# EAGLE design pianocircuit (EAGLE 9.6.2)
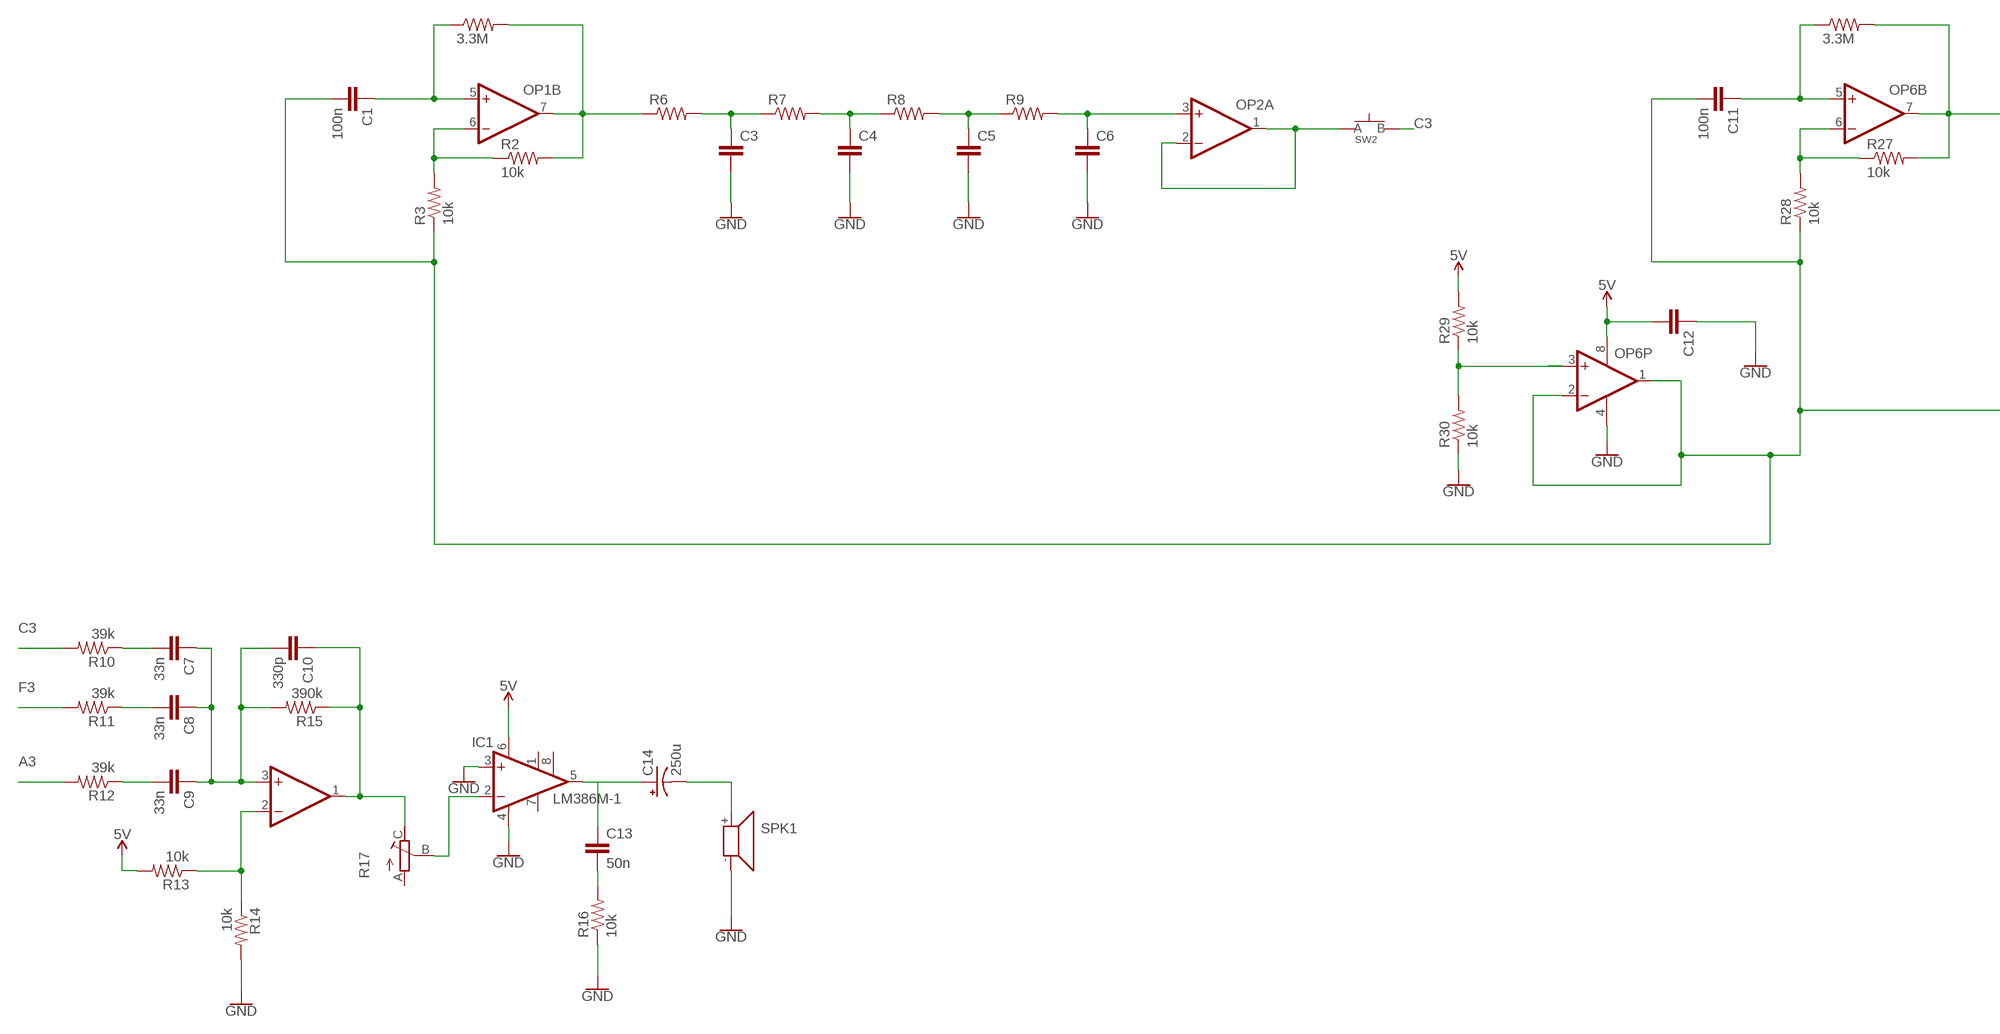
[diagram p0: schematic, sheet 1, part 1 of 2]
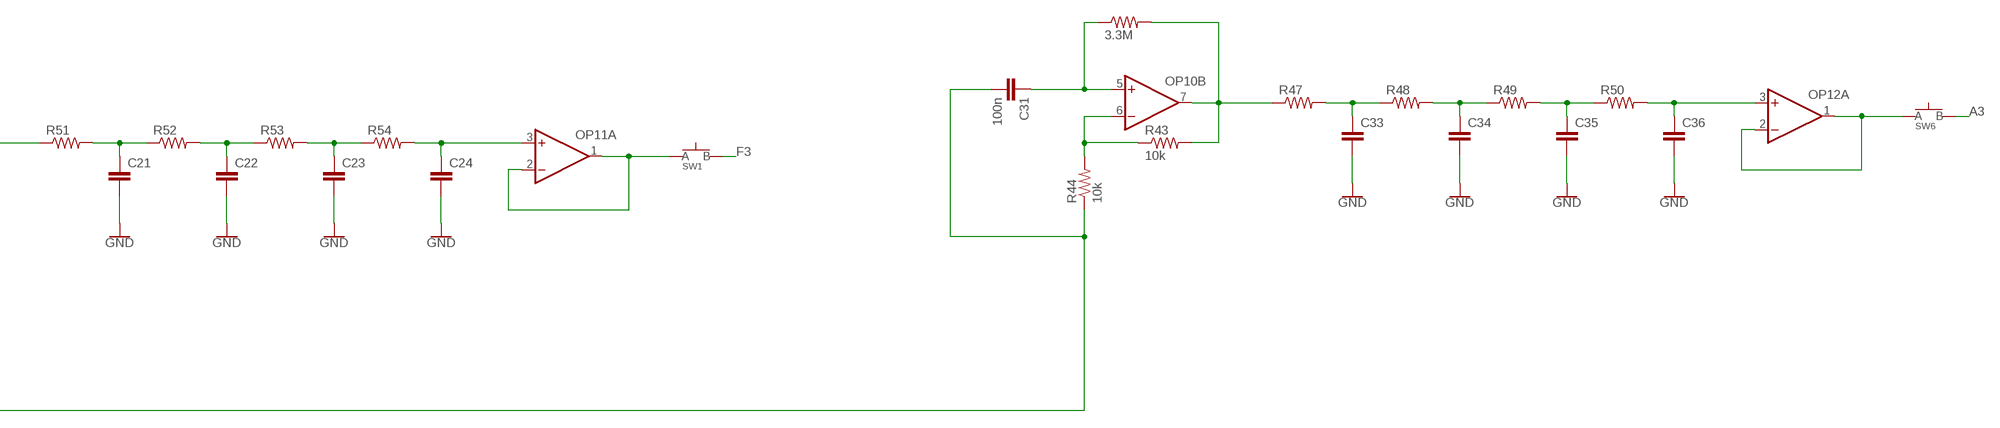
[diagram p1: schematic, sheet 1, part 2 of 2]

## Parts
C1  100n  CAPACITOR0603  [C0603]
C3  CAPACITOR0603  [C0603]
C4  CAPACITOR0603  [C0603]
C5  CAPACITOR0603  [C0603]
C6  CAPACITOR0603  [C0603]
C7  33n  CAPACITOR0603  [C0603]
C8  33n  CAPACITOR0603  [C0603]
C9  33n  CAPACITOR0603  [C0603]
C10  330p  CAPACITOR0603  [C0603]
C11  100n  CAPACITOR0603  [C0603]
C12  CAPACITOR0603  [C0603]
C13  50n  CAPACITOR0603  [C0603]
C14  250u  CAPACITOR.POLARC-EEU-FM-A-220UF  [C-EEU-FM-A-220UF]
C21  CAPACITOR0603  [C0603]
C22  CAPACITOR0603  [C0603]
C23  CAPACITOR0603  [C0603]
C24  CAPACITOR0603  [C0603]
C31  100n  CAPACITOR0603  [C0603]
C33  CAPACITOR0603  [C0603]
C34  CAPACITOR0603  [C0603]
C35  CAPACITOR0603  [C0603]
C36  CAPACITOR0603  [C0603]
IC1  LM386M-1  [SO08]
OP1  OP-DUALR  [SO8]
OP2  OP-DUALR  [SO8]
OP3  OP-DUALR  [SO8]
OP6  OP-DUALR  [SO8]
OP10  OP-DUALR  [SO8]
OP11  OP-DUALR  [SO8]
OP12  OP-DUALR  [SO8]
R1  3.3M  RESISTOR0603  [R0603]
R2  10k  RESISTOR0603  [R0603]
R3  10k  RESISTOR0603  [R0603]
R4  3.3M  RESISTOR0603  [R0603]
R6  RESISTOR0603  [R0603]
R7  RESISTOR0603  [R0603]
R8  RESISTOR0603  [R0603]
R9  RESISTOR0603  [R0603]
R10  39k  RESISTOR0603  [R0603]
R11  39k  RESISTOR0603  [R0603]
R12  39k  RESISTOR0603  [R0603]
R13  10k  RESISTOR0603  [R0603]
R14  10k  RESISTOR0603  [R0603]
R15  390k  RESISTOR0603  [R0603]
R16  10k  RESISTOR0603  [R0603]
R17  R-TRIMM-CB10V  [RTRIMCB10]
R26  3.3M  RESISTOR0603  [R0603]
R27  10k  RESISTOR0603  [R0603]
R28  10k  RESISTOR0603  [R0603]
R29  10k  RESISTOR0603  [R0603]
R30  10k  RESISTOR0603  [R0603]
R43  10k  RESISTOR0603  [R0603]
R44  10k  RESISTOR0603  [R0603]
R47  RESISTOR0603  [R0603]
R48  RESISTOR0603  [R0603]
R49  RESISTOR0603  [R0603]
R50  RESISTOR0603  [R0603]
R51  RESISTOR0603  [R0603]
R52  RESISTOR0603  [R0603]
R53  RESISTOR0603  [R0603]
R54  RESISTOR0603  [R0603]
SPK1  SPEAKER  [SOLDER.TABS]
SW1  SPST.KT11P4SM34LFS  [SPST.KT11P4SM34LFS]
SW2  SPST.KT11P4SM34LFS  [SPST.KT11P4SM34LFS]
SW6  SPST.KT11P4SM34LFS  [SPST.KT11P4SM34LFS]

## Nets
A3: R12.2 SW6.3(B) SW6.4(B)
C3: R10.2 SW2.3(B) SW2.4(B)
F3: R11.2 SW1.3(B) SW1.4(B)
N$2: C12.1 ; supply symbol labelled GND
N$3: C1.2 C11.2 C31.2 OP6.1(A:OUT) OP6.2(A:-IN) R3.1 R28.1 R44.1
N$4: OP1.6(B:-IN) R2.1 R3.2
N$5: C1.1 OP1.5(B:+IN) R1.1
N$6: OP1.7(B:OUT) R1.2 R2.2 R6.1
N$7: C3.1 R6.2 R7.1
N$8: C4.1 R7.2 R8.1
N$9: C5.1 R8.2 R9.1
N$10: C6.1 OP2.3(A:+IN) R9.2
N$11: OP2.1(A:OUT) OP2.2(A:-IN) SW2.1(A) SW2.2(A)
N$12: R4.2
N$14: C7.2 R10.1
N$15: C7.1 C8.1 C9.1 C10.2 OP3.3(A:+IN) R15.2
N$16: C9.2 R12.1
N$17: C8.2 R11.1
N$20: C10.1 OP3.1(A:OUT) R15.1 R17.C(E)
N$21: OP3.2(A:-IN) R13.1 R14.1
N$22: IC1.2(-IN) R17.B(S)
N$23: C13.2 R16.2
N$26: C13.1 C14.+ IC1.5(OUT)
N$27: OP6.3(A:+IN) R29.1 R30.2
N$29: OP6.6(B:-IN) R27.1 R28.2
N$30: C11.1 OP6.5(B:+IN) R26.1
N$31: OP6.7(B:OUT) R26.2 R27.2 R51.1
N$32: C14.- SPK1.+
N$52: C21.1 R51.2 R52.1
N$53: C22.1 R52.2 R53.1
N$54: C23.1 R53.2 R54.1
N$55: C24.1 OP11.3(A:+IN) R54.2
N$57: OP11.1(A:OUT) OP11.2(A:-IN) SW1.1(A) SW1.2(A)
N$58: OP10.6(B:-IN) R43.1 R44.2
N$60: C31.1 OP10.5(B:+IN) R4.1
N$61: OP10.7(B:OUT) R43.2 R47.1
N$62: C33.1 R47.2 R48.1
N$63: C34.1 R48.2 R49.1
N$64: C35.1 R49.2 R50.1
N$65: C36.1 OP12.3(A:+IN) R50.2
N$66: OP12.1(A:OUT) OP12.2(A:-IN) SW6.1(A) SW6.2(A)
V+: C12.2 IC1.6(VS) OP6.8(P:V+) R13.2 R29.2 ; supply symbol labelled 5V
V-: C3.2 C4.2 C5.2 C6.2 C21.2 C22.2 C23.2 C24.2 C33.2 C34.2 C35.2 C36.2 IC1.3(+IN) IC1.4(GND) OP6.4(P:V-) R14.2 R16.1 R30.1 SPK1.- ; supply symbol labelled GND
Unconnected: IC1.1(GAIN) IC1.7(BYPASS) IC1.8(GAIN) OP1.1(A:OUT) OP1.2(A:-IN) OP1.3(A:+IN) OP2.5(B:+IN) OP2.6(B:-IN) OP2.7(B:OUT) OP3.5(B:+IN) OP3.6(B:-IN) OP3.7(B:OUT) OP10.1(A:OUT) OP10.2(A:-IN) OP10.3(A:+IN) OP11.5(B:+IN) OP11.6(B:-IN) OP11.7(B:OUT) OP12.5(B:+IN) OP12.6(B:-IN) OP12.7(B:OUT) R17.A

## Power pins joined to a net without a drawn wire
V+: OP1.8(P:V+) OP2.8(P:V+) OP3.8(P:V+) OP10.8(P:V+) OP11.8(P:V+) OP12.8(P:V+)
V-: OP1.4(P:V-) OP2.4(P:V-) OP3.4(P:V-) OP10.4(P:V-) OP11.4(P:V-) OP12.4(P:V-)

## Library data of the parts
C1 C3-C13 C21-C24 C31 C33-C36 = LinnesLab-Passives:CAPACITOR
C14 = LinnesLab-Passives:CAPACITOR.POLAR
IC1 = linear:LM386?-*: Low Voltage Audio Power Amplifier Source: http://cache.national.com/ds/LM/LM386.pdf
OP1-OP3 OP6 OP10-OP12 = LinnesLab-AnalogIC:OP-DUAL: Precision Micropower, Low Noise CMOS, Rail-to-Rail Input/Output Operational Amplifiers Source: http://www.analog.com/static/imported-files/data_sheets/AD8603_8607_8609.pdf; MPN: AD8607ARMZ-R2; OC_FARNELL: 1651293; OC_NEWARK: 19M8927
R1-R4 R6-R16 R26-R30 R43 R44 R47-R54 = LinnesLab-Passives:RESISTOR
R17 = LinnesLab-Passives:R-TRIMM: Trimm resistor
SPK1 = LinnesLab-Electromechanical:SPEAKER
SW1 SW2 SW6 = LinnesLab-Switches:SPST.KT11P4SM34LFS: https://www.ckswitches.com/media/1468/kt.pdf

## Board
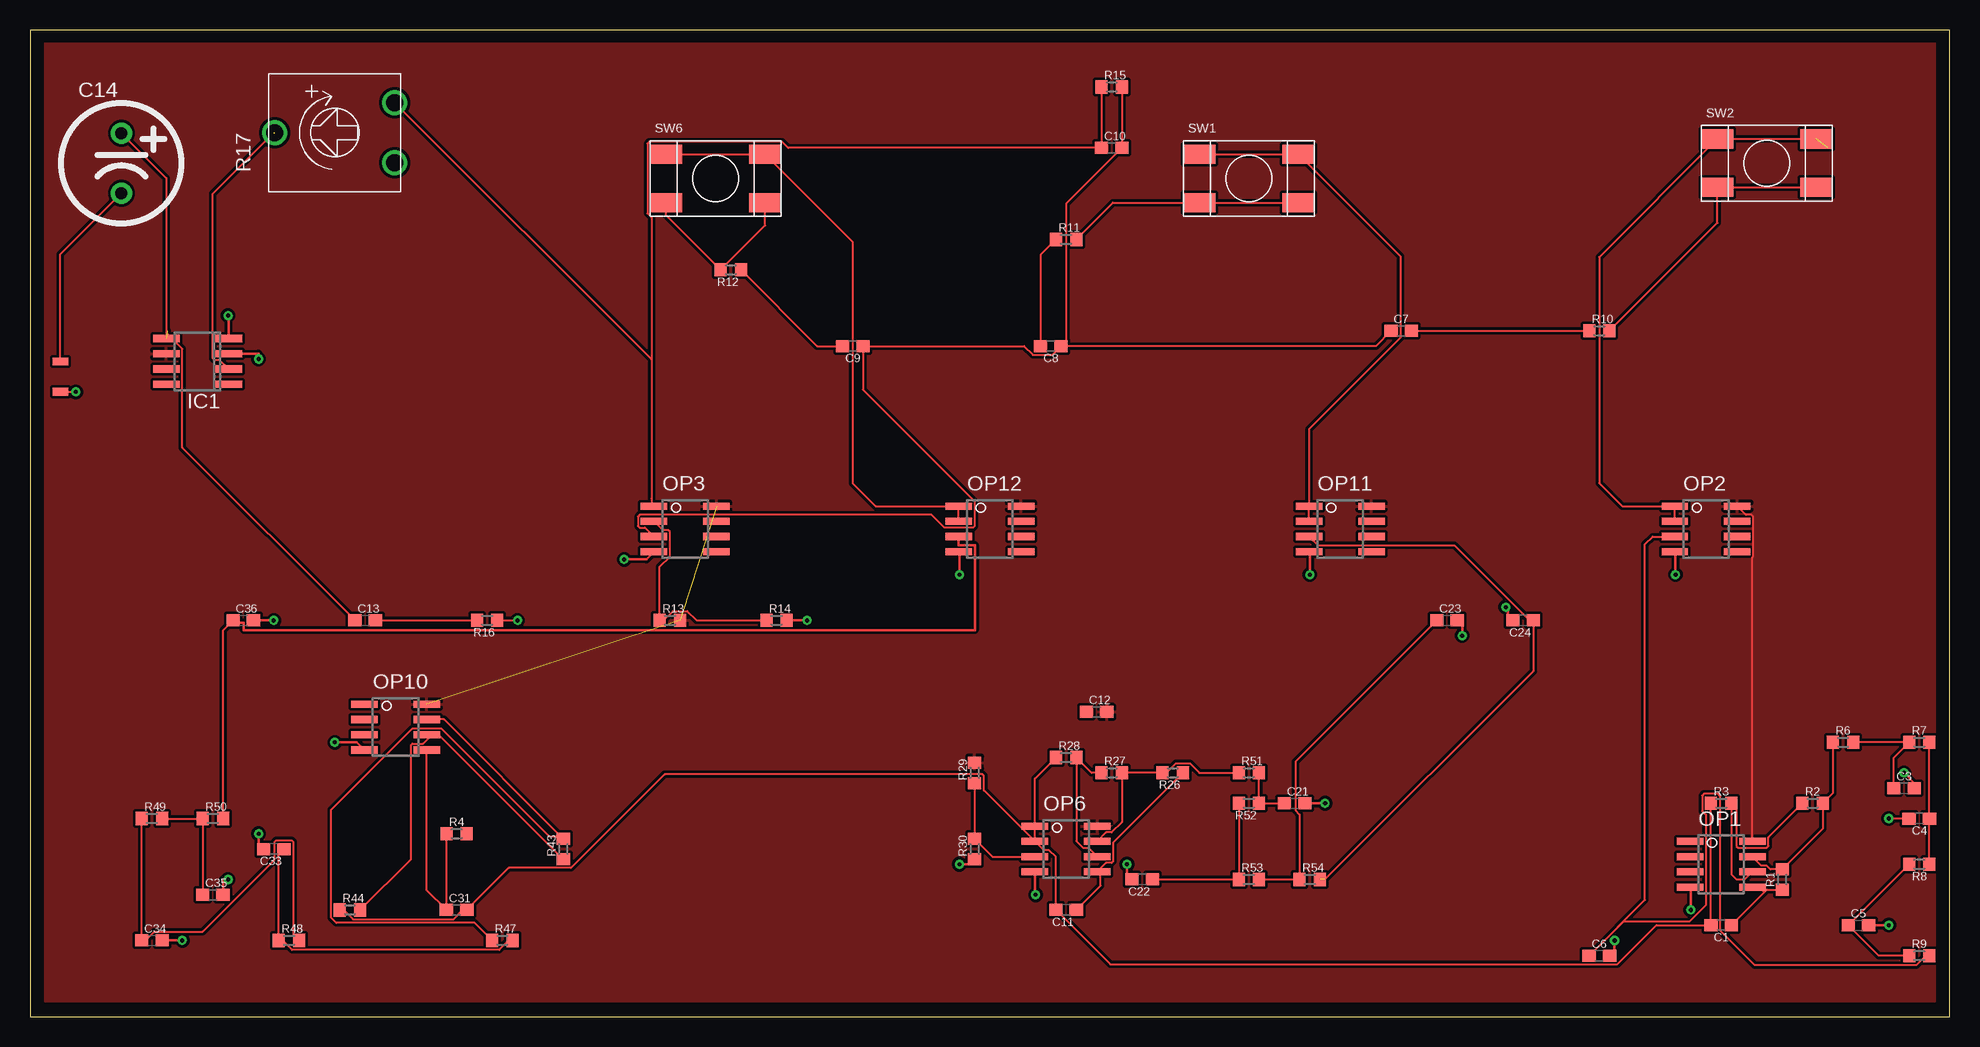
[diagram p2: board, top side]
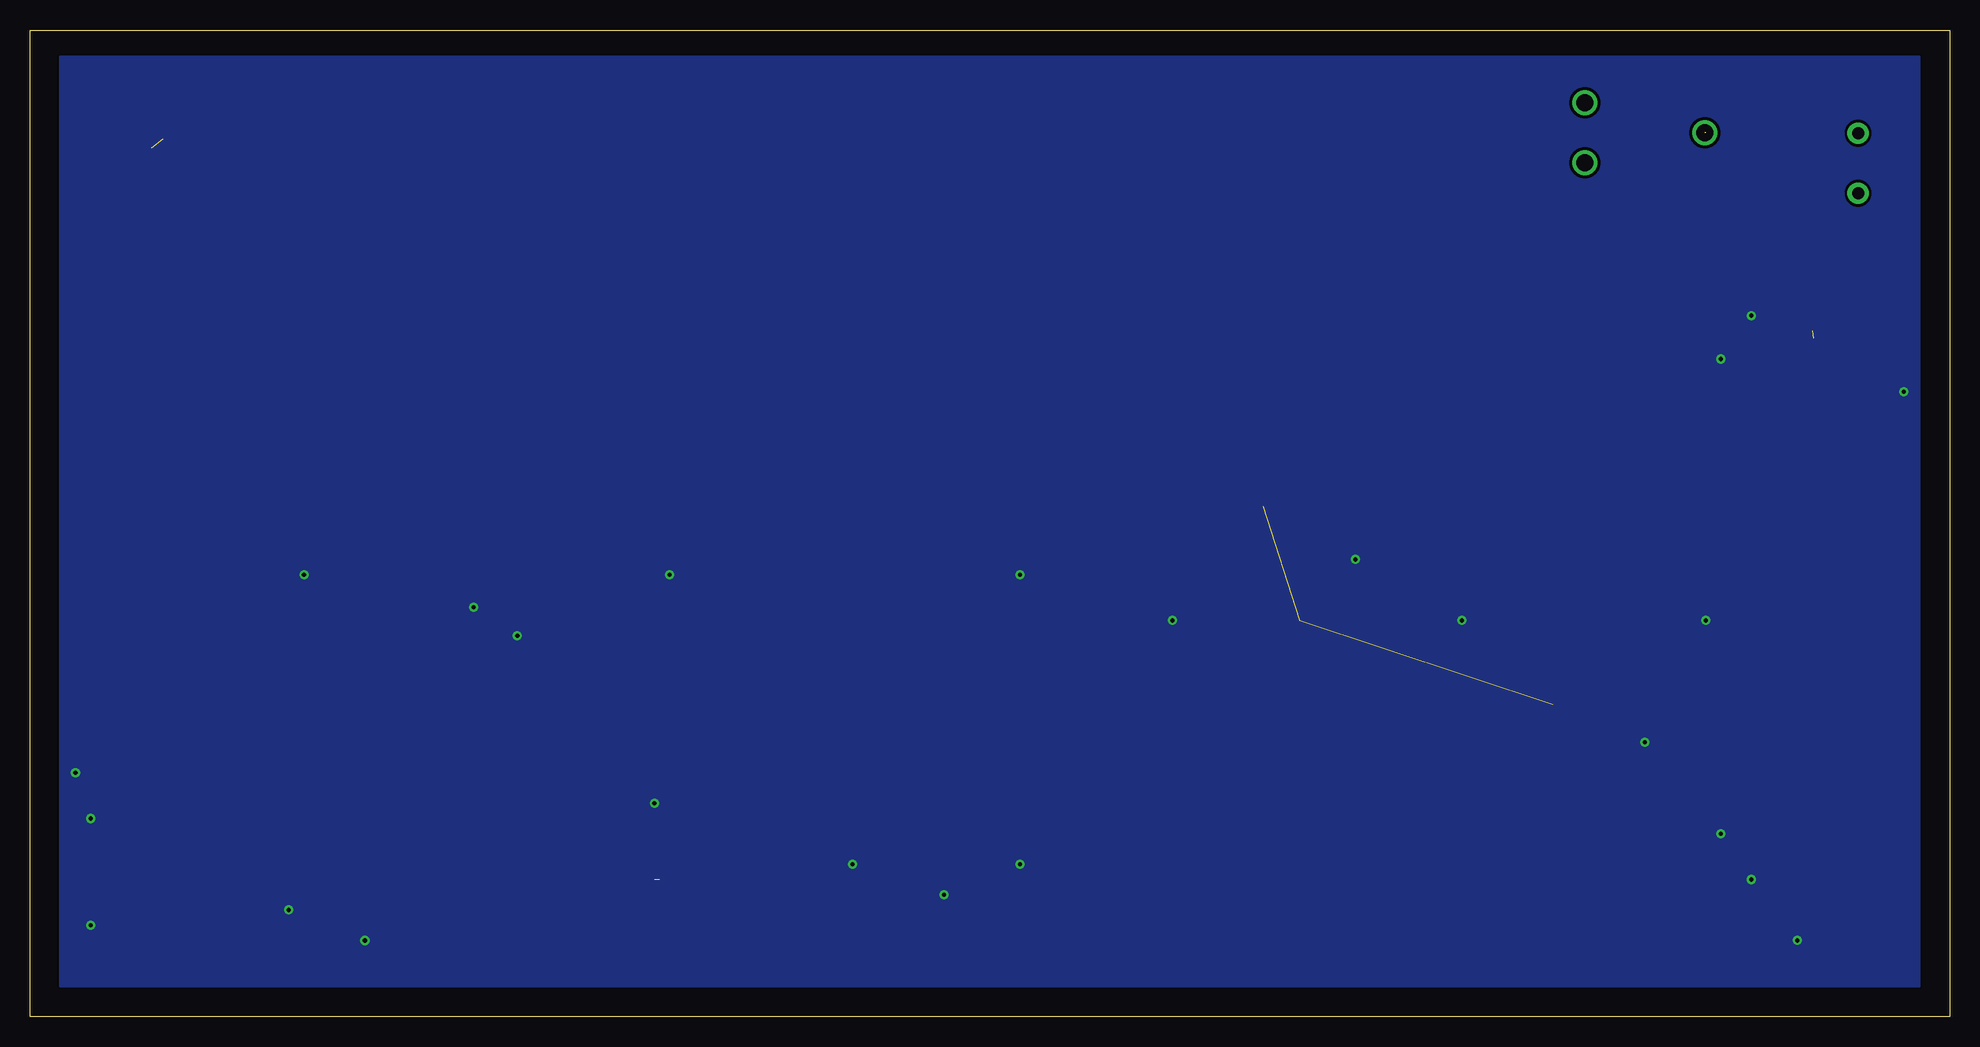
[diagram p3: board, bottom side, seen from below]

Size 160 x 82.22 mm. Coordinates in mm from the lower left corner, seen from the top.
Outline: 0,0 160,0 160,82.22 0,82.22 0,0
Copper layers (1*16): Top 0.035mm / dielectric 1.5mm / Bottom 0.035mm
Design rules "default": minimum track width 6mil, minimum drill 0.35mm, track to track 6mil, track to pad 6mil, pad to pad 6mil, via to via 6mil, smd to smd 6mil, copper to edge 40mil, drill to drill 6mil, minimum pad ring 10mil, minimum via ring 8mil, stop-mask expansion 4mil, vias tented up to drill 0mil, thermal gap 10mil

### Footprints (pad centres in the part's own frame; a part is rotated, then mirrored left to right if it is on the bottom)
C0603 = smd 1.1 x 1: 1 -0.85,0; 2 0.85,0
C-EEU-FM-A-220UF = drill 1 pad 1.778: + 0,2.5; - 0,-2.5
SO08 = smd 0.6 x 2.2: 1 -1.905,-2.6; 2 -0.635,-2.6; 3 0.635,-2.6; 4 1.905,-2.6; 5 1.905,2.6; 6 0.635,2.6; 7 -0.635,2.6; 8 -1.905,2.6
SO8 = smd 0.6 x 2.2: 1 -1.905,-2.6; 2 -0.635,-2.6; 3 0.635,-2.6; 4 1.905,-2.6; 5 1.905,2.6; 6 0.635,2.6; 7 -0.635,2.6; 8 -1.905,2.6
R0603 = smd 1 x 1.1: 1 -0.85,0; 2 0.85,0
RTRIMCB10 = drill 1.4: A -2.5,-5; B 0,5; C 2.5,-5
SOLDER.TABS = smd 1.27 x 0.635: + 0,1.27; - 0,-1.27
SPST.KT11P4SM34LFS = smd 2.665 x 1.59: 1 -4.128,2.02; 2 4.128,2.02; 3 -4.128,-2.02; 4 4.128,-2.02

### Placement (x,y rotation side)
C1  140.97,7.62 180 top
C3  156.21,19.05 0 top
C4  157.48,16.51 180 top
C5  152.4,7.62 0 top
C6  130.81,5.08 0 top
C7  114.3,57.15 0 top
C8  85.09,55.88 180 top
C9  68.58,55.88 180 top
C10  90.17,72.39 0 top
C11  86.36,8.89 180 top
C12  88.9,25.4 0 top
C13  27.94,33.02 0 top
C14  7.62,71.12 0 top
C21  105.41,17.78 0 top
C22  92.71,11.43 180 top
C23  118.11,33.02 0 top
C24  124.46,33.02 180 top
C31  35.56,8.89 0 top
C33  20.32,13.97 180 top
C34  10.16,6.35 0 top
C35  15.24,10.16 0 top
C36  17.78,33.02 0 top
IC1  13.97,54.61 90 top
OP1  140.97,12.7 270 top
OP2  139.7,40.64 270 top
OP3  54.61,40.64 270 top
OP6  86.36,13.97 270 top
OP10  30.48,24.13 270 top
OP11  109.22,40.64 270 top
OP12  80.01,40.64 270 top
R1  146.05,11.43 90 top
R2  148.59,17.78 0 top
R3  140.97,17.78 0 top
R4  35.56,15.24 0 top
R6  151.13,22.86 0 top
R7  157.48,22.86 0 top
R8  157.48,12.7 180 top
R9  157.48,5.08 0 top
R10  130.81,57.15 0 top
R11  86.36,64.77 0 top
R12  58.42,62.23 180 top
R13  53.34,33.02 0 top
R14  62.23,33.02 0 top
R15  90.17,77.47 0 top
R16  38.1,33.02 180 top
R17  25.4,73.66 90 top
R26  95.25,20.32 180 top
R27  90.17,20.32 0 top
R28  86.36,21.59 0 top
R29  78.74,20.32 90 top
R30  78.74,13.97 90 top
R43  44.45,13.97 90 top
R44  26.67,8.89 0 top
R47  39.37,6.35 0 top
R48  21.59,6.35 0 top
R49  10.16,16.51 0 top
R50  15.24,16.51 0 top
R51  101.6,20.32 0 top
R52  101.6,17.78 180 top
R53  101.6,11.43 0 top
R54  106.68,11.43 0 top
SPK1  2.54,53.34 0 top
SW1  101.6,69.85 0 top
SW2  144.78,71.12 0 top
SW6  57.15,69.85 0 top

### Tracks (layer width: path | path; a pad name or v marks a point on that pad's centre or on a via)
A3
  Top 0.152: SW6.3 53.02,66.78 R12.2 61.28,65.94 SW6.4
C3
  Top 0.152: SW2.4 SW2.3 140.65,66.14 R10.2
F3
  Top 0.152: SW1.4 97.79,67.83 SW1.3 90.27,67.83 R11.2
N$3
  Top 0.152: R44.1 26.15,8.89 26.93,8.11 35.3,8.11 36.08,8.89 C31.2 39.91,12.39 45.09,12.39 52.9,20.2 79.39,20.2 79.52,20.07 79.52,18.85 OP6.2 | OP6.2 84.5,13.86 84.95,13.86 85.51,13.31 C11.2 90.05,4.35 132.31,4.35 135.57,7.62 C1.2 R3.1 | OP6.2 OP6.1 83.76,19.84 R28.1
N$4
  Top 0.152: OP1.6 142.94,11.43 142.24,11.43 141.82,11.85 R3.2 142.24,17.36 142.24,14.21 142.38,14.08 144.76,14.08 144.9,14.21 144.9,14.94 R2.1
N$5
  Top 0.152: C1.1 144.57,10.37 | 144.57,10.37 144.78,10.58 R1.1 | OP1.5 144.15,10.79 144.57,10.37
N$6
  Top 0.152: R6.1 150.28,18.62 R2.2 149.44,15.67 R1.2 145.08,12.28 144.76,12.59 144.31,12.59 OP1.7
N$7
  Top 0.152: C3.1 155.36,21.59 R7.1 R6.2
N$8
  Top 0.152: R8.1 C4.1 R7.2
N$9
  Top 0.152: R9.1 154.09,5.08 C5.1 R8.2
N$10
  Top 0.152: OP2.3 135.25,40.01 134.62,39.37 134.62,9.74 C6.1 132.81,7.92 138.32,7.92 139.7,9.3 139.7,16.83 139.39,17.14 139.39,18.43 139.53,18.56 140.72,18.56 140.9,18.38 140.9,7.17 143.76,4.3 157.22,4.3 158,5.08 R9.2
N$11  (1 unrouted)
  Top 0.152: 149.86,72.39 149.11,73.14 SW2.1 130.81,63.3 130.81,44.45 132.72,42.55 OP2.1 OP2.2
N$14
  Top 0.152: C7.2 R10.1
N$15
  Top 0.152: R15.2 C10.2 86.36,67.73 86.36,56.3 C8.1 | C7.1 112.18,55.88 C8.1 | C8.1 85.21,55.15 83.59,55.15 82.87,55.88 C9.1 69.43,52.25 78.74,42.94 78.74,40.88 78.61,40.75 76.22,40.75 75.16,41.8 50.81,41.8 50.68,41.67 50.68,40.88 50.81,40.75 51.27,40.75 OP3.3
N$16
  Top 0.152: R12.1 65.62,55.88 C9.2
N$17
  Top 0.152: R11.1 84.24,63.5 C8.2
N$20
  Top 0.152: OP3.1 51.8,42.76 51.8,43.18 51.8,54.77 | R17.C 51.8,54.77 | R15.1 C10.1 63.21,72.39 62.7,72.89 51.59,72.89 51.46,72.76 51.46,66.94 51.8,66.61 51.8,54.77
N$21
  Top 0.152: OP3.2 52.75,40.53 53.2,40.53 53.34,40.4 53.34,38.34 52.49,37.49 R13.1 52.82,33.02 53.59,33.8 54.78,33.8 55.56,33.02 R14.1
N$22  (1 unrouted)
  Top 0.152: IC1.2 15.83,54.72 15.38,54.72 15.24,54.85 15.24,68.58 20.32,73.66
N$23
  Top 0.152: 28.79,33.44 C13.2 R16.2
N$26  (1 unrouted)
  Top 0.152: 27.42,33.02 C13.1 12.7,47.41 12.7,55.64 11.43,56.91 11.43,57.15 | C14.+ 11.37,69.87 IC1.5
N$27
  Top 0.152: OP6.3 80.22,13.34 R30.2 R29.1
N$29
  Top 0.152: R27.1 88.48,20.32 R28.2 87.21,14.63 87.77,14.08 88.22,14.08 OP6.6
N$30
  Top 0.152: R26.1 90.29,14.51 90.29,12.94 90.16,12.81 89.7,12.81 89.25,12.35 | 89.25,12.35 OP6.5 | C11.1 89.25,10.93 89.25,12.35
N$31
  Top 0.152: R51.1 97.47,20.32 96.69,21.1 95.5,21.1 94.73,20.32 R26.2 R27.2 91.02,16.21 90.16,15.35 89.7,15.35 OP6.7
N$32
  Top 0.152: SPK1.+ 2.54,63.54 C14.-
N$52
  Top 0.152: C21.1 R52.1 R51.2
N$53
  Top 0.152: C22.1 R53.1 R52.2
N$54
  Top 0.152: C23.1 105.48,21.24 105.48,17.18 105.83,16.84 R54.1 R53.2
N$55  (1 unrouted)
  Top 0.152: 107.95,11.43 125.31,28.79 C24.1 124.98,33.02 118.74,39.26 107.36,39.26 OP11.3
N$57
  Top 0.152: SW1.1 SW1.2 114.23,63.37 114.23,56.55 106.62,48.95 OP11.1 OP11.2
N$58
  Top 0.152: R44.2 31.75,13.12 31.75,22.62 31.89,22.75 32.77,22.75 33.3,23.28 OP10.6 34.08,23.5 R43.1
N$60
  Top 0.152: C31.1 34.98,8.89 | C31.1 33.08,10.52 OP10.5 | C31.1 R4.1
N$61
  Top 0.152: R43.2 44.24,15.03 | 44.24,15.03 34.51,24.77 OP10.7 | R47.1 37.06,7.81 25.53,7.81 25.09,8.24 25.09,17.23 31.89,24.02 34.27,24.02 43.27,15.03 44.24,15.03
N$62
  Top 0.152: R47.2 39.89,6.35 39.12,5.57 21.84,5.57 21.07,6.35 R48.1 20.74,13.54 C33.1
N$63
  Top 0.152: 8.89,5.93 C34.1 | C34.1 R49.1 | C34.1 9.64,6.35 10.37,7.08 14.38,7.08 20.39,13.09 20.39,14.56 20.52,14.7 21.82,14.7 21.95,14.56 21.95,6.84 R48.2
N$64
  Top 0.152: R49.2 R50.1 C35.1
N$65
  Top 0.152: R50.2 16.09,32.18 16.72,32.81 C36.1
  Top 0.203: OP12.3 77.41,39.29 78.76,39.29 78.76,32.22 17.83,32.22 17.83,32.81 16.72,32.81
N$66
  Top 0.152: SW6.1 SW6.2 68.58,64.57 68.58,44.45 70.48,42.55 OP12.1 OP12.2
V+  (2 unrouted)
  Top 0.152: OP1.8 143.57,38.28 143.63,38.34 143.63,41.67 143.5,41.8 143.04,41.8 OP2.8
  pour Top (isolate 0.229): 1.27,81.28 1.27,1.27 158.75,1.27 158.75,81.28
V-  (via drill 0.35)
  Top 0.152: C4.2 v154.94,16.51 | C3.2 157.06,19.47 v156.21,20.32 | SPK1.- v3.81,52.07 | R16.1 v40.64,33.02
  Top 0.203: C34.2 v12.7,6.35 | C35.2 16.09,11.43 v16.51,11.43 | C33.2 19.05,13.97 v19.05,15.24 | IC1.3 19.05,55.24 v19.05,54.81 19.05,54.61 | IC1.4 16.57,58.42 v16.51,58.42 | C36.2 v20.32,33.02 | R30.1 78.74,12.7 v77.47,12.7 | R14.2 v64.77,33.02 | C23.2 119.38,33.02 v119.38,31.75 | C24.2 123.19,33.02 123.19,34.29 123.02,34.29 v123.02,34.12 | C21.2 v107.95,17.78 | C22.2 91.44,11.43 v91.44,12.7 | OP6.4 83.76,10.16 v83.82,10.16 | C5.2 v154.94,7.62 | C6.2 132.08,5.08 v132.08,6.35 | OP3.4 51.38,38.1 v49.53,38.1 | OP12.4 77.47,38.73 v77.47,36.83 | OP10.4 27.25,22.86 v25.4,22.86 | OP11.4 106.68,38.73 v106.68,36.83 | OP1.4 138.43,10.79 v138.43,8.89 | OP2.4 137.16,38.73 v137.16,36.83
  pour Bottom (isolate 0.229): 2.54,80.01 2.54,2.54 157.48,2.54 157.48,80.01